# Altium schematic sheet AQCA-Light-Control-Blue-A0.SchDoc
size A4
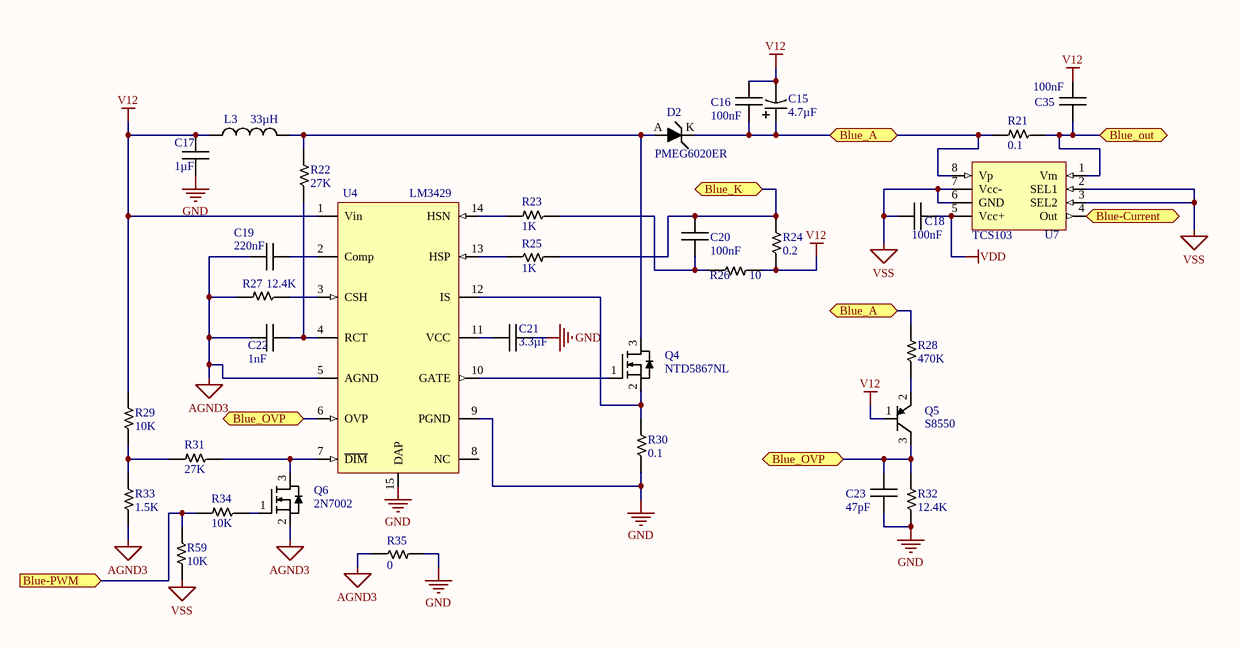
[diagram p0: AQCA-Light-Control-Blue-A0.SchDoc]

## Parts
C15  4.7µF  [CAPPR2-5x11]
C16  100nF  [CAPC2012N]
C17  1µF  [CAPC1608N]
C18  100nF  [CAPC1608N]
C19  220nF  [CAPC1608N]
C20  100nF  [CAPC1608N]
C21  3.3µF  [CAPC1608N]
C22  1nF  [CAPC1608N]
C23  47pF  [CAPC1608N]
C35  100nF  [CAPC2012N]
D2  PMEG6020ER  [SOD123]
L3  33µH  [Inductor AIUR5-6]
Q4  NTD5867NL  [DPAK 369AA]
Q5  S8550  [SOT23_N]
Q6  2N7002  [SOT23-3N]
R21  0.1  [RESC2012N]
R22  27K  [RESC1608N]
R23  1K  [RESC1608N]
R24  0.2  [RESC6332N]
R25  1K  [RESC1608N]
R26  10  [RESC1608N]
R27  12.4K  [RESC1608N]
R28  470K  [RESC1608N]
R29  10K  [RESC1608N]
R30  0.1  [RESC6332N]
R31  27K  [RESC1608N]
R32  12.4K  [RESC1608N]
R33  1.5K  [RESC1608N]
R34  10K  [RESC1608N]
R35  0  [RESC1608N]
R59  10K  [RESC1608N]
U4  LM3429  [TSOP65P640_HS-14N]
U7  TCS103  [TSSOP8N_N]

## Ports
Blue-Current, Blue-PWM (in), Blue_A, Blue_K, Blue_out, Blue_OVP

## Nets
AGND3: C19.1 C22.1 Q6.2(S) R27.2 R33.1 R35.1 U4.5(AGND)
GND: C17.1 C21.1 C23.1 R30.1 R32.1 R35.2 U4.9(PGND) U4.15(DAP)
V12: C15.2 C16.2 C17.2 C35.2 L3.1 Q5.1(B) R24.1 R26.2 R29.2 U4.1(Vin)
VDD: C18.1 U7.5(Vcc+)
VSS: C18.2 R59.2 U7.2(SEL1) U7.3(SEL2) U7.6(GND) U7.7(Vcc-)
Blue-Current: U7.4(Out) ; port Blue-Current
Blue-PWM: R34.2 R59.1 ; port Blue-PWM
Blue_A: C15.1 C16.1 D2.K(Kathode) R21.2 R28.2 U7.8(Vp) ; port Blue_A
Blue_K: C20.2 R24.2 R25.2 ; port Blue_K
Blue_out: C35.1 R21.1 U7.1(Vm) ; port Blue_out
Blue_OVP: C23.2 Q5.3(C) R32.2 U4.6(OVP) ; port Blue_OVP
NetC19_2: C19.2 U4.2(Comp)
NetC20_1: C20.1 R23.1 R26.1
NetC21_2: C21.2 U4.11(VCC)
NetC22_2: C22.2 R22.1 U4.4(RCT)
NetD2_A: D2.A(Anode) L3.2 Q4.3(D) R22.2
NetQ4_1: Q4.1(G) U4.10(GATE)
NetQ4_2: Q4.2(S) R30.2 U4.12(IS)
NetQ5_2: Q5.2(E) R28.1
NetQ6_1: Q6.1(G) R34.1
NetQ6_3: Q6.3(D) R31.1 U4.7(~{DIM})
NetR23_2: R23.2 U4.14(HSN)
NetR25_1: R25.1 U4.13(HSP)
NetR27_1: R27.1 U4.3(CSH)
NetR29_1: R29.1 R31.2 R33.2

Not connected (* = marked no-connect by the designer): U4 8(NC)

## Library data of the parts
C15 = Capacitor Polarised: Voltage: 100V; Value: 4.7µF
C16 C23 C35 = Capacitor: Voltage: 100V
  C16 C35: Value: 100nF
  C23: Value: 47pF
C17 C19 = Capacitor: Voltage: 25V
  C17: Value: 1µF
  C19: Value: 220nF
C18 C21 = Capacitor: Voltage: 16V
  C18: Value: 100nF
  C21: Value: 3.3µF
C20 C22 = Capacitor: Voltage: 50V
  C20: Value: 100nF
  C22: Value: 1nF
D2 = Schottky Diode: pin to pad: A>1 K>2; Vf: 0.46V; Vr: 60V; If: 2A; Model: PMEG6020ER
L3 = Inductor: DC Current: 5.2A; Value: 33µH
Q4 = MOSFET N-Ch: pin to pad: 2>3 3>4; Vdss: 60V; Id: 20A; RdsON: 0.05; Model: NTD5867NL
Q5 = PNP: pin to pad: 1>3 3>1; Model: S8550
Q6 = MOSFET N-Ch: Vdss: 60V; Id: 115mA; RdsON: 7.5; Model: 2N7002
R21-R35 R59 = Resistor
  R21 R30: Value: 0.1
  R22 R31: Value: 27K
  R23 R25: Value: 1K
  R24: Value: 0.2
  R26: Value: 10
  R27 R32: Value: 12.4K
  R28: Value: 470K
  R29 R34 R59: Value: 10K
  R33: Value: 1.5K
  R35: Value: 0